# Altium schematic sheet Connector_EEM.SchDoc: =SheetTitle_Top
size 420 x 297 mm; EDA_Number: ARTIQ; Author: G.Kasprowicz; CompanyName: WUT ISE; DrawnBy: G.Kasprowicz; Organization: WUT ISE; Address1: PW ISE; Address2: Nowowiejska 15/19 00-665 Warsaw; Address3: gkasprow@gmail.com; ModifiedBy: -; CheckedDate: -; Title2: EEM Connectors; DivGrp: WUT ISE; Designer: G.Kasprowicz; ModifiedDate: -; ProjectName: Sensor Box
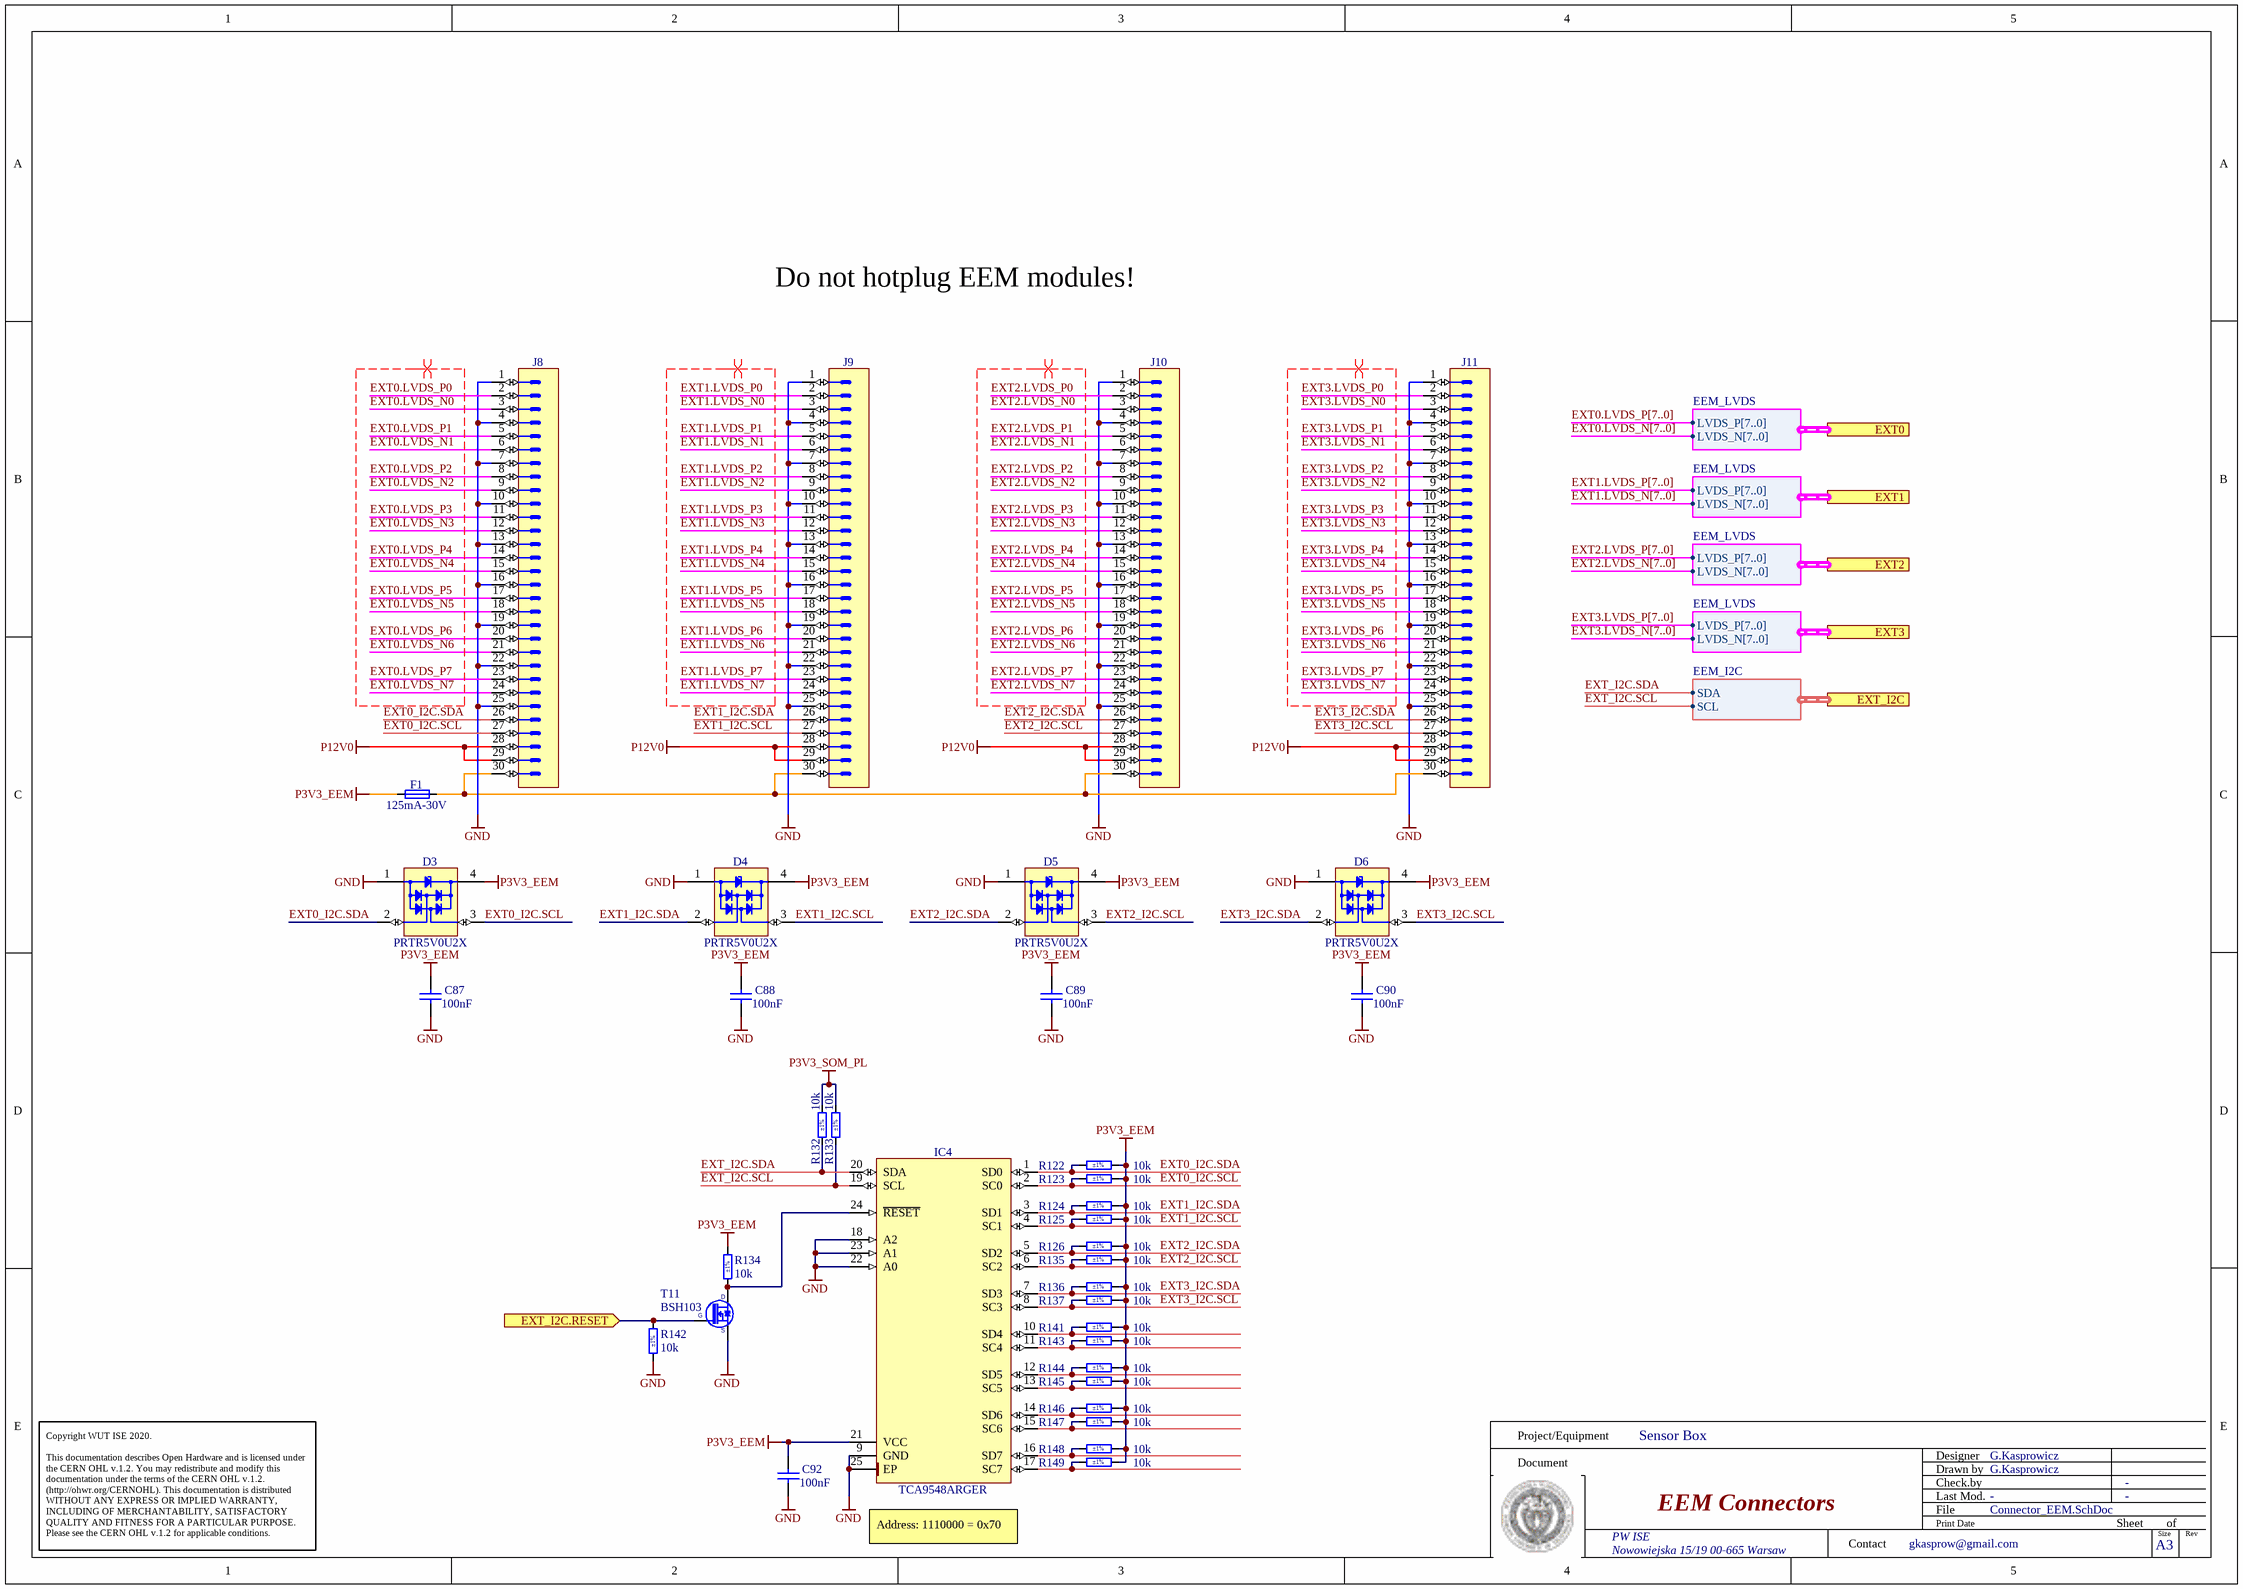
[diagram p0: Connector_EEM.SchDoc]

## Parts
C87  100nF  [CAPC1005X55N]
C88  100nF  [CAPC1005X55N]
C89  100nF  [CAPC1005X55N]
C90  100nF  [CAPC1005X55N]
C92  100nF  [CAPC1005X55N]
D3  PRTR5V0U2X  [SOT190P230X110-4N]
D4  PRTR5V0U2X  [SOT190P230X110-4N]
D5  PRTR5V0U2X  [SOT190P230X110-4N]
D6  PRTR5V0U2X  [SOT190P230X110-4N]
F1  125mA-30V  [FUSR_LITTELFUSE_1206L012]
IC4  TCA9548ARGER  [QFN50P400X400X100-25N-S220]
J8  (no value)  [3M_N2530-6002RB]
J9  (no value)  [3M_N2530-6002RB]
J10  (no value)  [3M_N2530-6002RB]
J11  (no value)  [3M_N2530-6002RB]
R122  10k  Tolerance: ±1%  [RESC1005X40N]
R123  10k  Tolerance: ±1%  [RESC1005X40N]
R124  10k  Tolerance: ±1%  [RESC1005X40N]
R125  10k  Tolerance: ±1%  [RESC1005X40N]
R126  10k  Tolerance: ±1%  [RESC1005X40N]
R132  10k  Tolerance: ±1%  [RESC1005X40N]
R133  10k  Tolerance: ±1%  [RESC1005X40N]
R134  10k  Tolerance: ±1%  [RESC1005X40N]
R135  10k  Tolerance: ±1%  [RESC1005X40N]
R136  10k  Tolerance: ±1%  [RESC1005X40N]
R137  10k  Tolerance: ±1%  [RESC1005X40N]
R141  10k  Tolerance: ±1%  [RESC1005X40N]
R142  10k  Tolerance: ±1%  [RESC1005X40N]
R143  10k  Tolerance: ±1%  [RESC1005X40N]
R144  10k  Tolerance: ±1%  [RESC1005X40N]
R145  10k  Tolerance: ±1%  [RESC1005X40N]
R146  10k  Tolerance: ±1%  [RESC1005X40N]
R147  10k  Tolerance: ±1%  [RESC1005X40N]
R148  10k  Tolerance: ±1%  [RESC1005X40N]
R149  10k  Tolerance: ±1%  [RESC1005X40N]
T11  BSH103  [SOT95P230X110-3N]

## Ports
EXT0 (harness EEM_LVDS), EXT1 (harness EEM_LVDS), EXT2 (harness EEM_LVDS), EXT3 (harness EEM_LVDS), EXT_I2C (harness EEM_I2C), EXT_I2C.RESET (in)

## Harnesses
EEM_LVDS: LVDS_N[7..0], LVDS_P[7..0]
EEM_I2C: SCL, SDA

## Nets
GND: C87.1 C88.1 C89.1 C90.1 C92.1 D3.1(GND) D4.1(GND) D5.1(GND) D6.1(GND) IC4.9(GND) IC4.18(A2) IC4.22(A0) IC4.23(A1) IC4.25(EP) J8.1 J8.4 J8.7 J8.10 J8.13 J8.16 J8.19 J8.22 J8.25 J9.1 J9.4 J9.7 J9.10 J9.13 J9.16 J9.19 J9.22 J9.25 J10.1 J10.4 J10.7 J10.10 J10.13 J10.16 J10.19 J10.22 J10.25 J11.1 J11.4 J11.7 J11.10 J11.13 J11.16 J11.19 J11.22 J11.25 R142.1 T11.2(S)
P3V3_EEM: C87.2 C88.2 C89.2 C90.2 C92.2 D3.4(VCC) D4.4(VCC) D5.4(VCC) D6.4(VCC) F1.1 IC4.21(VCC) R122.2 R123.2 R124.2 R125.2 R126.2 R134.2 R135.2 R136.2 R137.2 R141.2 R143.2 R144.2 R145.2 R146.2 R147.2 R148.2 R149.2
P3V3_SOM_PL: R132.2 R133.2
P12V0: J8.28 J8.29 J9.28 J9.29 J10.28 J10.29 J11.28 J11.29
EXT0.LVDS_N0: J8.3
EXT0.LVDS_N1: J8.6
EXT0.LVDS_N2: J8.9
EXT0.LVDS_N3: J8.12
EXT0.LVDS_N4: J8.15
EXT0.LVDS_N5: J8.18
EXT0.LVDS_N6: J8.21
EXT0.LVDS_N7: J8.24
EXT0.LVDS_P0: J8.2
EXT0.LVDS_P1: J8.5
EXT0.LVDS_P2: J8.8
EXT0.LVDS_P3: J8.11
EXT0.LVDS_P4: J8.14
EXT0.LVDS_P5: J8.17
EXT0.LVDS_P6: J8.20
EXT0.LVDS_P7: J8.23
EXT0_I2C.SCL: D3.3(I/O2) IC4.2(SC0) J8.27 R123.1
EXT0_I2C.SDA: D3.2(I/O1) IC4.1(SD0) J8.26 R122.1
EXT1.LVDS_N0: J9.3
EXT1.LVDS_N1: J9.6
EXT1.LVDS_N2: J9.9
EXT1.LVDS_N3: J9.12
EXT1.LVDS_N4: J9.15
EXT1.LVDS_N5: J9.18
EXT1.LVDS_N6: J9.21
EXT1.LVDS_N7: J9.24
EXT1.LVDS_P0: J9.2
EXT1.LVDS_P1: J9.5
EXT1.LVDS_P2: J9.8
EXT1.LVDS_P3: J9.11
EXT1.LVDS_P4: J9.14
EXT1.LVDS_P5: J9.17
EXT1.LVDS_P6: J9.20
EXT1.LVDS_P7: J9.23
EXT1_I2C.SCL: D4.3(I/O2) IC4.4(SC1) J9.27 R125.1
EXT1_I2C.SDA: D4.2(I/O1) IC4.3(SD1) J9.26 R124.1
EXT2.LVDS_N0: J10.3
EXT2.LVDS_N1: J10.6
EXT2.LVDS_N2: J10.9
EXT2.LVDS_N3: J10.12
EXT2.LVDS_N4: J10.15
EXT2.LVDS_N5: J10.18
EXT2.LVDS_N6: J10.21
EXT2.LVDS_N7: J10.24
EXT2.LVDS_P0: J10.2
EXT2.LVDS_P1: J10.5
EXT2.LVDS_P2: J10.8
EXT2.LVDS_P3: J10.11
EXT2.LVDS_P4: J10.14
EXT2.LVDS_P5: J10.17
EXT2.LVDS_P6: J10.20
EXT2.LVDS_P7: J10.23
EXT2_I2C.SCL: D5.3(I/O2) IC4.6(SC2) J10.27 R135.1
EXT2_I2C.SDA: D5.2(I/O1) IC4.5(SD2) J10.26 R126.1
EXT3.LVDS_N0: J11.3
EXT3.LVDS_N1: J11.6
EXT3.LVDS_N2: J11.9
EXT3.LVDS_N3: J11.12
EXT3.LVDS_N4: J11.15
EXT3.LVDS_N5: J11.18
EXT3.LVDS_N6: J11.21
EXT3.LVDS_N7: J11.24
EXT3.LVDS_P0: J11.2
EXT3.LVDS_P1: J11.5
EXT3.LVDS_P2: J11.8
EXT3.LVDS_P3: J11.11
EXT3.LVDS_P4: J11.14
EXT3.LVDS_P5: J11.17
EXT3.LVDS_P6: J11.20
EXT3.LVDS_P7: J11.23
EXT3_I2C.SCL: D6.3(I/O2) IC4.8(SC3) J11.27 R137.1
EXT3_I2C.SDA: D6.2(I/O1) IC4.7(SD3) J11.26 R136.1
EXT_I2C.RESET: R142.2 T11.1(G) ; port EXT_I2C.RESET
EXT_I2C.SCL: IC4.19(SCL) R133.1 ; port EXT_I2C.SCL
EXT_I2C.SDA: IC4.20(SDA) R132.1 ; port EXT_I2C.SDA
NetF1_2: F1.2 J8.30 J9.30 J10.30 J11.30
NetIC4_10: IC4.10(SD4) R141.1
NetIC4_11: IC4.11(SC4) R143.1
NetIC4_12: IC4.12(SD5) R144.1
NetIC4_13: IC4.13(SC5) R145.1
NetIC4_14: IC4.14(SD6) R146.1
NetIC4_15: IC4.15(SC6) R147.1
NetIC4_16: IC4.16(SD7) R148.1
NetIC4_17: IC4.17(SC7) R149.1
NetIC4_24: IC4.24(~{RESET}) R134.1 T11.3(D)

## Buses and harness runs
bus EXT0.LVDS_N[7..0]
bus EXT0.LVDS_P[7..0]
bus EXT1.LVDS_N[7..0]
bus EXT1.LVDS_P[7..0]
bus EXT2.LVDS_N[7..0]
bus EXT2.LVDS_P[7..0]
bus EXT3.LVDS_N[7..0]
bus EXT3.LVDS_P[7..0]

## Layout directives
differential pair: EXT0.LVDS_N0, EXT0.LVDS_N1, EXT0.LVDS_N2, EXT0.LVDS_N3, EXT0.LVDS_N4, EXT0.LVDS_N5, EXT0.LVDS_N6, EXT0.LVDS_N7, EXT0.LVDS_P0, EXT0.LVDS_P1, EXT0.LVDS_P2, EXT0.LVDS_P3, EXT0.LVDS_P4, EXT0.LVDS_P5, EXT0.LVDS_P6, EXT0.LVDS_P7, EXT1.LVDS_N0, EXT1.LVDS_N1, EXT1.LVDS_N2, EXT1.LVDS_N3, EXT1.LVDS_N4, EXT1.LVDS_N5, EXT1.LVDS_N6, EXT1.LVDS_N7, EXT1.LVDS_P0, EXT1.LVDS_P1, EXT1.LVDS_P2, EXT1.LVDS_P3, EXT1.LVDS_P4, EXT1.LVDS_P5, EXT1.LVDS_P6, EXT1.LVDS_P7, EXT2.LVDS_N0, EXT2.LVDS_N1, EXT2.LVDS_N2, EXT2.LVDS_N3, EXT2.LVDS_N4, EXT2.LVDS_N5, EXT2.LVDS_N6, EXT2.LVDS_N7, EXT2.LVDS_P0, EXT2.LVDS_P1, EXT2.LVDS_P2, EXT2.LVDS_P3, EXT2.LVDS_P4, EXT2.LVDS_P5, EXT2.LVDS_P6, EXT2.LVDS_P7, EXT3.LVDS_N0, EXT3.LVDS_N1, EXT3.LVDS_N2, EXT3.LVDS_N3, EXT3.LVDS_N4, EXT3.LVDS_N5, EXT3.LVDS_N6, EXT3.LVDS_N7, EXT3.LVDS_P0, EXT3.LVDS_P1, EXT3.LVDS_P2, EXT3.LVDS_P3, EXT3.LVDS_P4, EXT3.LVDS_P5, EXT3.LVDS_P6, EXT3.LVDS_P7

## Notes on the sheet
- Do not hotplug EEM modules!
- (near IC4) Address: 1110000 = 0x70
- Project/Equipment
- Document
- Designer
- Drawn by
- Check.by
- Copyright WUT ISE 2020.
  This documentation describes Open Hardware and is licensed under the CERN OHL v.1.2. You may redistribute and modify this documentation under the terms of the CERN OHL v.1.2. (http://ohwr.org/CERNOHL). This documentation is distributed WITHOUT ANY EXPRESS OR IMPLIED WARRANTY, INCLUDING OF MERCHANTABILITY, SATISFACTORY QUALITY AND FITNESS FOR A PARTICULAR PURPOSE. Please see the CERN OHL v.1.2 for applicable conditions.
- Contact
- File
- Last Mod.
- Print Date
- Sheet
- Size
- A3
- of
- Rev

## Library data of the parts
C87-C90 C92 = CC0402_100NF_16V_10%_X5R: Non-polarised capacitor; Part Description: SMD Multilayer Chip Ceramic Capacitor; Manufacturer: GENERIC; Manufacturer1 Part Number: GRM155R61C104KA88D; Voltage: 16V; TC: X5R; Tolerance: ±10%; Part Number: CC0402_100NF_16V_10%_X5R; Component Kind: Standard; Component Type: Standard; Pin Count: 2; Value: 100nF; Status: None; Manufacturer Part Number: CC0402_100NF_16V_10%_X5R; Case: 0402; Mounted: Yes; Socket: No; SMD: Yes; Sense: No; Manufacturer1 Example: MURATA; Manufacturer1 ComponentHeight: 0.55mm; HelpURL: \\cern.ch\dfs\Applications\Altium\Datasheets\CC0402_X5R_MURATA_GRM.pdf; Author: CERN DEM JLC; CreateDate: 10.12.2013; LatestRevisionDate: 10.12.2013
D3-D6 = PRTR5V0U2X: Ultra Low Capacitance Double Rail-to-Rail ESD Protection Diode; Part Description: Ultra Low Capacitance (1pF) Double Rail-to-Rail ESD Protection Diode (8kV); Manufacturer: NXP SEMICONDUCTORS; Voltage: 5.5V; PressFit: No; Bonding: No; Part Number: PRTR5V0U2X; Component Kind: Standard; Component Type: Standard; Device: PRTR5V0U2X; PackageDescription: SOT143B, SOT, 1.90mm Pitch; 4 Pin, 1.30mm W X 2.90mm L X 1.10mm H body, IPC Medium Density; Manufacturer Part Number: PRTR5V0U2X; Pin Count: 4; Case: SOT143B; Mounted: Yes; Socket: No; SMD: Yes; Sense: No; ComponentHeight: 1.1mm; HelpURL: \\cern.ch\dfs\Applications\Altium\Datasheets\PRTR5V0U2X.pdf; Author: CERN DEM JLC; CreateDate: 22.03.2011; LatestRevisionDate: 22.03.2011
F1 = FUSR_LITTELFUSE_1206L012: Fuse; Part Description: POLYFUSE® Surface Mount Resettable PTC; Manufacturer Part Number: 1206L012WR; PressFit: No; Part Number: FUSR_LITTELFUSE_1206L012; Component Kind: Standard; Component Type: Standard; Pin Count: 2; PackageDescription: Surface Mount POLY-FUSE® Resettable PTC, 1206L Series; Family: Fuses Resettable; Mounted: Yes; Socket: No; SMD: Yes; Sense: No; Value: 125mA-30V; Manufacturer: LITTELFUSE; ComponentHeight: 1.45mm; HelpURL: \\cern.ch\dfs\Applications\Altium\Datasheets\FUSR_LITTELFUSE_1206L012.pdf; Author: CERN DEM JLC; CreateDate: 19.12.2011; LatestRevisionDate: 19.12.2011
IC4 = TCA9548ARGER: Low Voltage 8-Channel I2C Switch With Reset; Manufacturer: TEXAS INSTRUMENTS; PressFit: No; Bonding: No; Part Number: TCA9548ARGER; Component Kind: Standard; Component Type: Standard; Device: TCA9548ARGER; PackageDescription: QFN, 0.50mm Pitch, Square; 24 Pin, 4.00mm L X 4.00mm W X 1.00mm H body (w/thermal tab 2.2 X 2.2mm), IPC Medium Density; Part Description: Low Voltage 8-Channel I2C Switch With Reset; Manufacturer Part Number: TCA9548ARGER; Pin Count: 25; Case: QFN24; Mounted: Yes; Socket: No; SMD: Yes; Sense: No; ComponentHeight: 1mm; Author: CERN DEM JLC; HelpURL: \\cern.ch\dfs\Applications\Altium\Datasheets\TCA9548ARGER.pdf; CreateDate: 07.07.2014; LatestRevisionDate: 07.07.2014
J8-J11 = 3M_N2530-6002RB: Connector 30 Male; Part Description: 30 Contacts - Straight .100'' x .100'' Low Profile Four-Wall Header, 2500 Series; Manufacturer: 3M; PressFit: No; Part Number: 3M_N2530-6002RB; Component Kind: Standard; Component Type: Standard; Pin Count: 30; Family: Header 30; Mounted: Yes; Socket: No; SMD: No; Sense: No; Status: None; Manufacturer Part Number: N2530-6002RB; ComponentHeight: 10.03mm; HelpURL: \\cern.ch\dfs\Applications\Altium\Datasheets\3M_N2530-6002RB.pdf; Author: CERN DEM JLC; CreateDate: 11.02.2009; LatestRevisionDate: 11.08.2009
R122-R126 R132-R137 R141-R149 = R0402_10K_1%_0.0625W_100PPM: Resistor - 1%; Part Description: General Purpose Thick Film Chip Resistor; Manufacturer: GENERIC; Manufacturer1 Part Number: 232270671003L; TC: ±100ppm/°C; PressFit: No; Part Number: R0402_10K_1%_0.0625W_100PPM; Component Kind: Standard; Component Type: Standard; Pin Count: 2; Value: 10k; Status: Not Recommended; Power: 0.0625W; Manufacturer Part Number: R0402_10K_1%_0.0625W_100PPM; Case: 0402; Mounted: Yes; Sense: No; Socket: No; SMD: Yes; Manufacturer1 Example: YAGEO PHYCOMP; Manufacturer1 ComponentHeight: 0.4mm; HelpURL: \\cern.ch\dfs\Applications\Altium\Datasheets\R0402_Phycomp_RC0402.pdf; Author: CERN DEM JLC; CreateDate: 03.12.2007; LatestRevisionDate: 17.10.2012
T11 = BSH103: N-CHANNEL MOSFET WITH DIODE; Part Description: 30V 850mA N-Channel Enhancement Mode Field-Effect Transistor; Manufacturer: NEXPERIA; PressFit: No; Bonding: No; Part Number: BSH103; Component Kind: Standard; Component Type: Standard; Device: BSH103; PackageDescription: SOT23, 3 pin, Pitch 0.95mm - 1.3mm W X 2.9mm L X 1.1mm H, IPC Medium Density; Manufacturer Part Number: BSH103; Pin Count: 3; Case: SOT23-3; Mounted: Yes; Socket: No; SMD: Yes; Sense: No; ComponentHeight: 1.1mm; HelpURL: \\cern.ch\dfs\Applications\Altium\Datasheets\BSH103.pdf; Author: CERN DEM JLC; CreateDate: 16.03.2010; LatestRevisionDate: 20.06.2017; ClassName: Artix